# EAGLE design systems-controller (EAGLE 7.6.0)

## Sheet 1 of 4: Power Supply
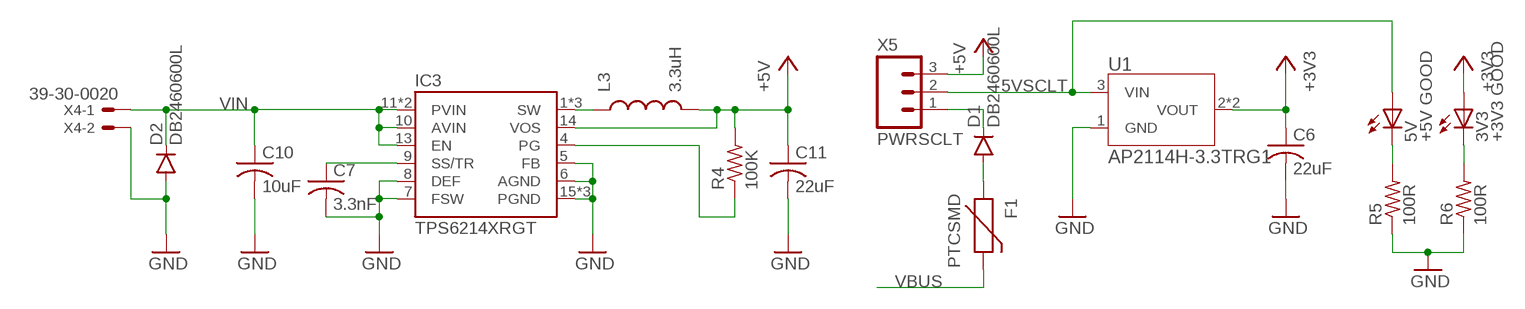
[diagram p0: schematic, sheet 1]

### Parts
3V3  +3V3 GOOD  LEDSML0603  [SML0603]
5V  +5V GOOD  LEDSML0603  [SML0603]
C6  22uF  C-USC0805K  [C0805K]
C7  3.3nF  C-USC0603K  [C0603K]
C10  10uF  C-USC0805K  [C0805K]
C11  22uF  C-USC0805K  [C0805K]
D1  DB2460600L  DIODESOD128  [SOD-128]
D2  DB2460600L  DIODESOD128  [SOD-128]
F1  PTCSMD  [PTC-1206]
IC3  TPS6214XRGT  [16-VQFN]
L3  3.3uH  INDUCTOR-SRN5020  [SRN5020]
R4  100K  R-US_R0603  [R0603]
R5  100R  R-US_R0603  [R0603]
R6  100R  R-US_R0603  [R0603]
U1  AP2114H-3.3TRG1  [SOT-223]
X4  39-30-0020  [39-30-0020]
X5  PWRSCLT  M03PTH  [1X03]

### Nets
5VSCLT: 5V.A U1.3(VIN) X5.2
+3V3: 3V3.A C6.1 U1.2(VOUT) U1.4(VOUT) ; also sheet 2
+5V: C11.1 IC3.14(VOS) L3.2 R4.2 X5.3 ; also sheet 3
GND: C6.2 C7.2 C10.2 C11.2 D2.A IC3.5(FB) IC3.6(AGND) IC3.7(FSW) IC3.8(DEF) IC3.15(PGND) IC3.16(PGND) IC3.PAD(PGND) R5.1 R6.1 U1.1(GND) X4.2 ; also sheet 2,3,4
N$13: IC3.4(PG) R4.1
N$14: C7.1 IC3.9(SS/TR)
N$16: D1.C X5.1
N$17: IC3.1(SW) IC3.2(SW) IC3.3(SW) L3.1
N$20: D1.A F1.1
N$23: 5V.C R5.2
N$24: 3V3.C R6.2
VBUS: F1.2 ; also sheet 2
VIN: C10.1 D2.C IC3.10(AVIN) IC3.11(PVIN) IC3.12(PVIN) IC3.13(EN) X4.1 ; also sheet 3

## Sheet 2 of 4: Microcontroller
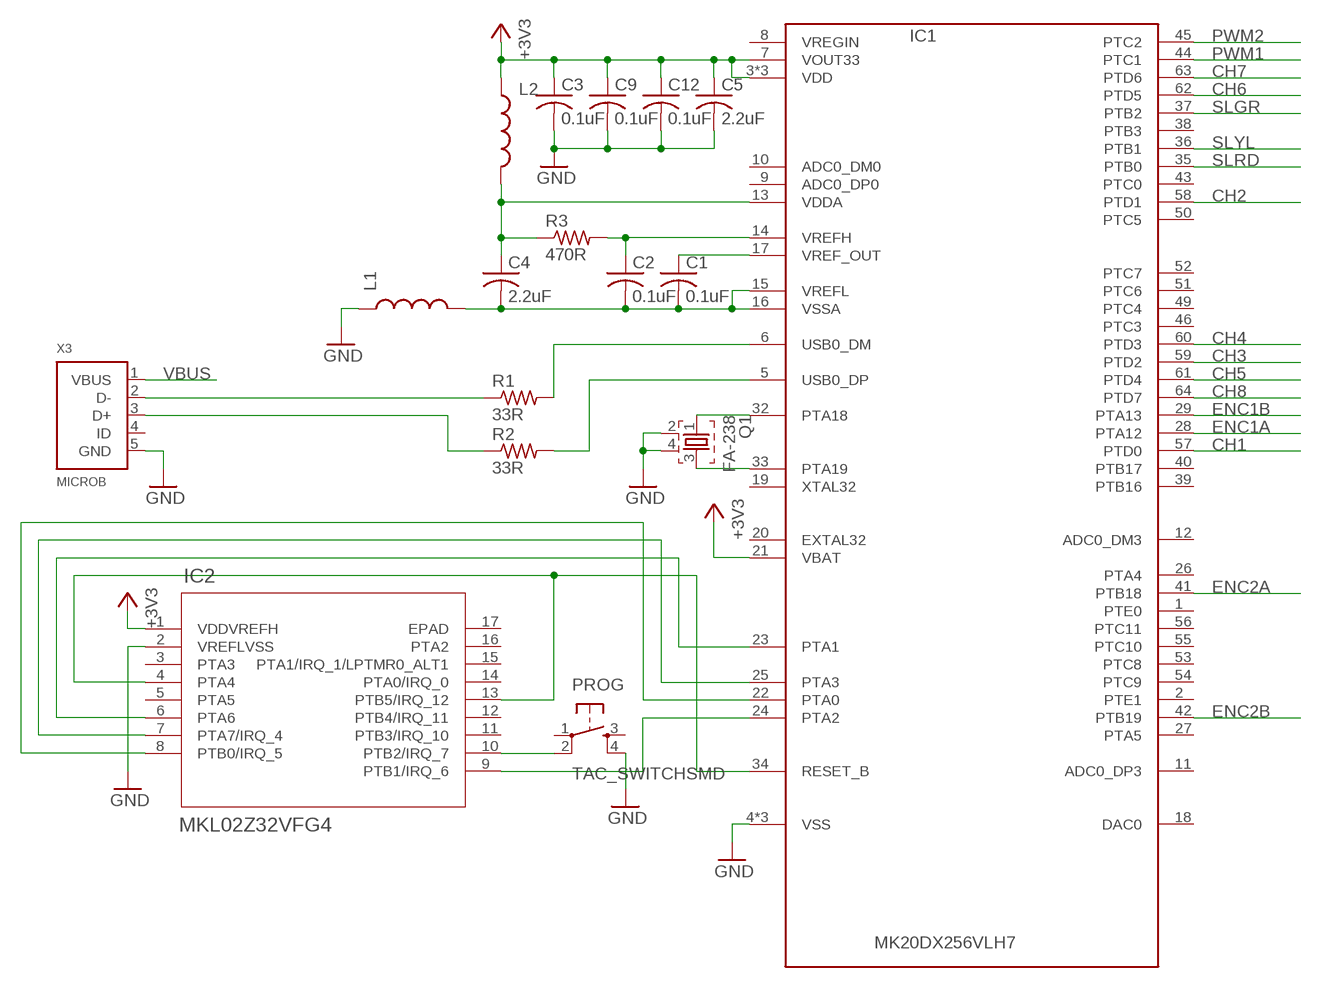
[diagram p1: schematic, sheet 2]

### Parts
C1  0.1uF  C-USC0603K  [C0603K]
C2  0.1uF  C-USC0603K  [C0603K]
C3  0.1uF  C-USC0603K  [C0603K]
C4  2.2uF  C-USC0603K  [C0603K]
C5  2.2uF  C-USC0603K  [C0603K]
C9  0.1uF  C-USC0603K  [C0603K]
C12  0.1uF  C-USC0603K  [C0603K]
IC1  MK20DX256VLH7  [MK20DX256VLH7]
IC2  MKL02Z32VFG4  [QFN-16_3X3X0.65]
L1  INDUCTOR30OHM,1.8A  [0603]
L2  INDUCTOR30OHM,1.8A  [0603]
PROG  TAC_SWITCHSMD  [TACTILE-SWITCH-SMD]
Q1  FA-238  [FA-238]
R1  33R  R-US_R0603  [R0603]
R2  33R  R-US_R0603  [R0603]
R3  470R  R-US_R0603  [R0603]
X3  MICROB  [10118192]

### Nets
+3V3: C3.1 C5.1 C9.1 C12.1 IC1.3(VDD) IC1.7(VOUT33) IC1.21(VBAT) IC1.30(VDD) IC1.48(VDD) IC2.1(VDDVREFH) L2.1 ; also sheet 1
CH1: IC1.57(PTD0) ; also sheet 3
CH2: IC1.58(PTD1) ; also sheet 3
CH3: IC1.59(PTD2) ; also sheet 3
CH4: IC1.60(PTD3) ; also sheet 3
CH5: IC1.61(PTD4) ; also sheet 3
CH6: IC1.62(PTD5) ; also sheet 3
CH7: IC1.63(PTD6) ; also sheet 3
CH8: IC1.64(PTD7) ; also sheet 3
ENC1A: IC1.28(PTA12) ; also sheet 3
ENC1B: IC1.29(PTA13) ; also sheet 3
ENC2A: IC1.41(PTB18) ; also sheet 3
ENC2B: IC1.42(PTB19) ; also sheet 3
GND: C3.2 C5.2 C9.2 C12.2 IC1.4(VSS) IC1.31(VSS) IC1.47(VSS) IC2.2(VREFLVSS) L1.1 PROG.4 Q1.2 Q1.4 X3.5(GND) ; also sheet 1,3,4
N$1: IC1.25(PTA3) IC2.7(PTA7/IRQ_4)
N$2: IC1.22(PTA0) IC2.8(PTB0/IRQ_5)
N$3: IC1.24(PTA2) IC2.9(PTB1/IRQ_6)
N$4: IC1.23(PTA1) IC2.6(PTA6)
N$5: IC1.34(RESET_B) IC2.4(PTA4) IC2.13(PTB5/IRQ_12)
N$6: R1.1 X3.2(D-)
N$7: IC1.6(USB0_DM) R1.2
N$8: R2.1 X3.3(D+)
N$9: IC1.5(USB0_DP) R2.2
N$10: IC1.32(PTA18) Q1.1
N$11: IC1.33(PTA19) Q1.3
N$12: C1.2 C2.2 C4.2 IC1.15(VREFL) IC1.16(VSSA) L1.2
N$15: C1.1 IC1.17(VREF_OUT)
N$18: C2.1 IC1.14(VREFH) R3.2
N$21: C4.1 IC1.13(VDDA) L2.2 R3.1
N$22: IC2.10(PTB2/IRQ_7) PROG.2
PWM1: IC1.44(PTC1) ; also sheet 3
PWM2: IC1.45(PTC2) ; also sheet 3
SLGR: IC1.37(PTB2) ; also sheet 4
SLRD: IC1.35(PTB0) ; also sheet 4
SLYL: IC1.36(PTB1) ; also sheet 4
VBUS: X3.1(VBUS) ; also sheet 1
Unconnected: IC1.1(PTE0) IC1.2(PTE1) IC1.8(VREGIN) IC1.9(ADC0_DP0) IC1.10(ADC0_DM0) IC1.11(ADC0_DP3) IC1.12(ADC0_DM3) IC1.18(DAC0) IC1.19(XTAL32) IC1.20(EXTAL32) IC1.26(PTA4) IC1.27(PTA5) IC1.38(PTB3) IC1.39(PTB16) IC1.40(PTB17) IC1.43(PTC0) IC1.46(PTC3) IC1.49(PTC4) IC1.50(PTC5) IC1.51(PTC6) IC1.52(PTC7) IC1.53(PTC8) IC1.54(PTC9) IC1.55(PTC10) IC1.56(PTC11) IC2.3(PTA3) IC2.5(PTA5) IC2.11(PTB3/IRQ_10) IC2.12(PTB4/IRQ_11) IC2.14(PTA0/IRQ_0) IC2.15(PTA1/IRQ_1/LPTMR0_ALT1) IC2.16(PTA2) IC2.17(EPAD) PROG.1 PROG.3 X3.4(ID)

## Sheet 3 of 4: External Connections
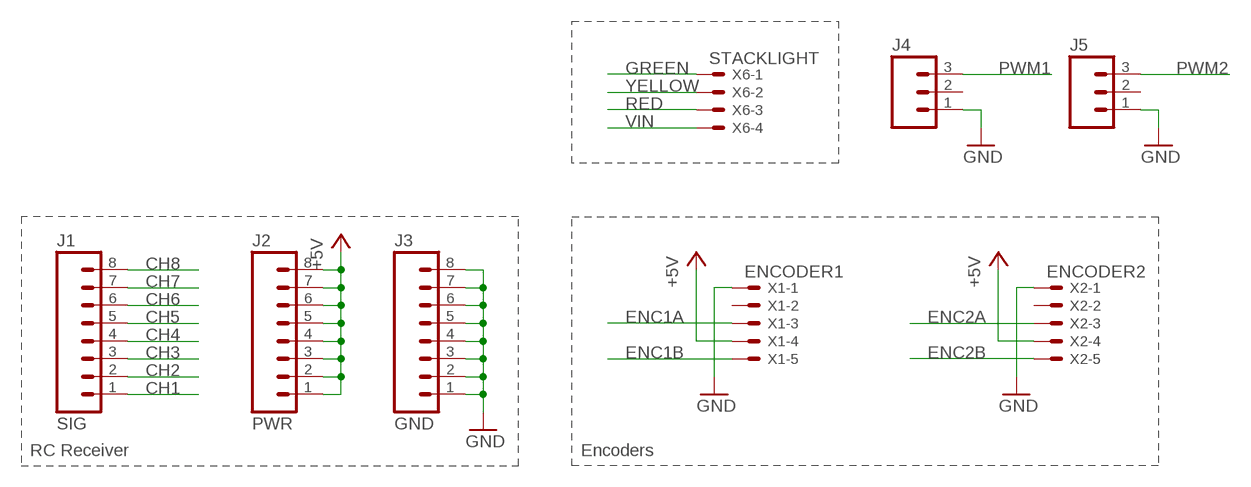
[diagram p2: schematic, sheet 3]

### Parts
J1  SIG  M08  [1X08_ROUND]
J2  PWR  M08  [1X08_ROUND]
J3  GND  M08  [1X08_ROUND]
J4  M03PTH  [1X03]
J5  M03PTH  [1X03]
X1  ENCODER1  C-GRID-05-70553  [70553-05]
X2  ENCODER2  C-GRID-05-70553  [70553-05]
X6  STACKLIGHT  C-GRID-04-70553  [70553-04]

### Nets
+5V: J2.1 J2.2 J2.3 J2.4 J2.5 J2.6 J2.7 J2.8 X1.4 X2.4 ; also sheet 1
CH1: J1.1 ; also sheet 2
CH2: J1.2 ; also sheet 2
CH3: J1.3 ; also sheet 2
CH4: J1.4 ; also sheet 2
CH5: J1.5 ; also sheet 2
CH6: J1.6 ; also sheet 2
CH7: J1.7 ; also sheet 2
CH8: J1.8 ; also sheet 2
ENC1A: X1.3 ; also sheet 2
ENC1B: X1.5 ; also sheet 2
ENC2A: X2.3 ; also sheet 2
ENC2B: X2.5 ; also sheet 2
GND: J3.1 J3.2 J3.3 J3.4 J3.5 J3.6 J3.7 J3.8 J4.1 J5.1 X1.1 X2.1 ; also sheet 1,2,4
GREEN: X6.1 ; also sheet 4
PWM1: J4.3 ; also sheet 2
PWM2: J5.3 ; also sheet 2
RED: X6.3 ; also sheet 4
VIN: X6.4 ; also sheet 1
YELLOW: X6.2 ; also sheet 4
Unconnected: J4.2 J5.2 X1.2 X2.2

### Notes on the sheet
- RC Receiver | Encoders

## Sheet 4 of 4: Stack Light FETs
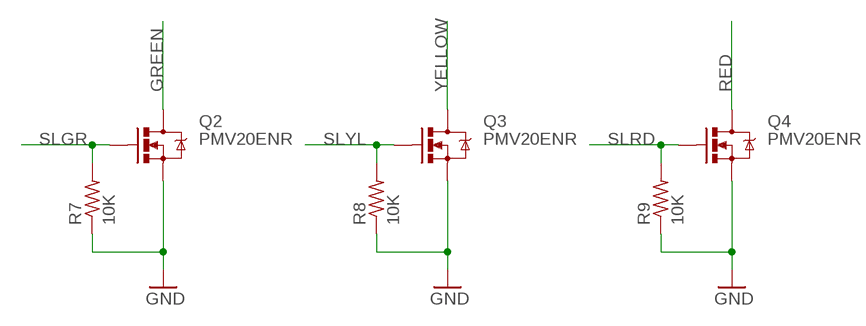
[diagram p3: schematic, sheet 4]

### Parts
Q2  PMV20ENR  MOSFET-NCHANNELAO3404A  [SOT23-3]
Q3  PMV20ENR  MOSFET-NCHANNELAO3404A  [SOT23-3]
Q4  PMV20ENR  MOSFET-NCHANNELAO3404A  [SOT23-3]
R7  10K  R-US_R0603  [R0603]
R8  10K  R-US_R0603  [R0603]
R9  10K  R-US_R0603  [R0603]

### Nets
GND: Q2.2(S) Q3.2(S) Q4.2(S) R7.1 R8.1 R9.1 ; also sheet 1,2,3
GREEN: Q2.3(D) ; also sheet 3
RED: Q4.3(D) ; also sheet 3
SLGR: Q2.1(G) R7.2 ; also sheet 2
SLRD: Q4.1(G) R9.2 ; also sheet 2
SLYL: Q3.1(G) R8.2 ; also sheet 2
YELLOW: Q3.3(D) ; also sheet 3

## Library data of the parts
3V3 5V = led:LED: LED OSRAM: - CHIPLED LG R971, LG N971, LY N971, LG Q971, LY Q971, LO R971, LY R971 LH N974, LH R974 LS Q976, LO Q976, LY Q976 LO Q996 - Hyper CHIPLED LW Q18S LB Q993, LB Q99A, LB R99A - SideLED LS A670, LO A670, LY A670, LG A670, LP A670 LB A673, LV A673, LT A673, LW A673 LH A674 LY A675 LS A676, LA A676, LO A676, LY A676, LW A676 LS A679, LY A679, LG A679 - Hyper Micro SIDELED® LS Y876, LA Y876, LO Y876, LY Y876 LT Y87S - SmartLED LW L88C, LW L88S LB L89C, LB L89S, LG L890 LS L89K, LO L89K, LY L89K LS L896, LA L896, LO L896, LY L896 - TOPLED LS T670, LO T670, LY T670, LG T670, LP T670 LSG T670, LSP T670, LSY T670, LOP T670, LYG T670 LG T671, LOG T671, LSG T671 LB T673, LV T673, LT T673, LW T673 LH T674 LS T676, LA T676, LO T676, LY T676, LB T676, LH T676, LSB T676, LW T676 LB T67C, LV T67C, LT T67C, LS T67K, LO T67K, LY T67K, LW E67C LS E67B, LA E67B, LO E67B, LY E67B, LB E67C, LV E67C, LT E67C LW T67C LS T679, LY T679, LG T679 LS T770, LO T770, LY T770, LG T770, LP T770 LB T773, LV T773, LT T773, LW T773 LH T774 LS E675, LA E675, LY E675, LS T675 LS T776, LA T776, LO T776, LY T776, LB T776 LHGB T686 LT T68C, LB T68C - Hyper Mini TOPLED® LB M676 - Mini TOPLED Santana® LG M470 LS M47K, LO M47K, LY M47K Source: http://www.osram.convergy.de LUXEON: - LUMILED® LXK2-PW12-R00, LXK2-PW12-S00, LXK2-PW14-U00, LXK2-PW14-V00 LXK2-PM12-R00, LXK2-PM12-S00, LXK2-PM14-U00 LXK2-PE12-Q00, LXK2-PE12-R00, LXK2-PE12-S00, LXK2-PE14-T00, LXK2-PE14-U00 LXK2-PB12-K00, LXK2-PB12-L00, LXK2-PB12-M00, LXK2-PB14-N00, LXK2-PB14-P00, LXK2-PB14-Q00 LXK2-PR12-L00, LXK2-PR12-M00, LXK2-PR14-Q00, LXK2-PR14-R00 LXK2-PD12-Q00, LXK2-PD12-R00, LXK2-PD12-S00 LXK2-PH12-R00, LXK2-PH12-S00 LXK2-PL12-P00, LXK2-PL12-Q00, LXK2-PL12-R00 Source: www.luxeon.com KINGBRIGHT: KA-3528ASYC Source: www.kingbright.com
C1-C7 C9-C12 = resistor:C-US: CAPACITOR, American symbol
D1 D2 = SparkFun-DiscreteSemi:DIODE: Diode These are standard reverse protection diodes and small signal diodes. SMA package can handle up to about 1A. SOD-323 can handle about 200mA. What the SOD-323 package when ordering, there are some mfgs out there that are 5-pin packages.
F1 = SparkFun-PowerIC:PTC: Resettable Fuse PTC Resettable Fuse. Spark Fun Electronics SKU : COM-08357; PROD_ID: RES-11150
IC1 = TeensyCustom:MK20DX256VLH7: Teensy 3.1 Processing Unit - MK20DX256VLH7 ARM Cortex M4 Datasheet: K20P64M50SF0.pdf <http://cache.freescale.com/files/32bit/doc/data_sheet/K20P64M50SF0.pdf>
IC2 = TeensyCustom:MKL02Z32VFG4; CPU: ARM Cortex-M0+; FLASHKB: 32; MANUFACTURER_PART_NUMBER: mkl02z32vfg4; MAXFREQUENCY: 48; PINCOUNT: 16; SRAMKB: 4; VENDOR: FREESCALE
IC3 = texas:TPS6214X: TPS6214x 3-V to 17-V 2-A Step-Down Converter in 3 × 3 QFN Package Source: TPS6214x Datasheet <http://www.ti.com/lit/ds/symlink/tps62140.pdf>
J1-J3 = SparkFun-Connectors:M08: Header 8 Standard 8-pin 0.1" header. Use with straight break away headers (SKU : PRT-00116), right angle break away headers (PRT-00553), swiss pins (PRT-00743), machine pins (PRT-00117), and female headers (PRT-00115).; PROD_ID: CONN-08437
J4 J5 X5 = SparkFun-Connectors:M03: Header 3 Standard 3-pin 0.1" header. Use with straight break away headers (SKU : PRT-00116), right angle break away headers (PRT-00553), swiss pins (PRT-00743), machine pins (PRT-00117), and female headers (PRT-00115). Molex polarized connector foot print use with SKU : PRT-08232 with associated crimp pins and housings.
L1 L2 = SparkFun-Passives:INDUCTOR: Inductors Basic Inductor/Choke - 0603 and 1206. Footprints are not proven and vary greatly between part numbers. INDUCTOR POWER 3.3UH 4.0A SMD 0.197" L x 0.197" W x 0.177" H (5.00mm x 5.00mm x 4.50mm); PROD_ID: RES-07859
L3 = bourns:INDUCTOR-: Inductor
PROG = SparkFun-Retired:TAC_SWITCH: Momentary Switch Button commonly used for reset or general input. Spark Fun Electronics SKU : COM-00097 SMT- SWCH-08247; PROD_ID: SWCH-08247
Q1 = crystal:FA-: MHz RANGE CRYSTAL UNIT Source: Epson Toyocom
Q2-Q4 = SparkFun-DiscreteSemi:MOSFET-NCHANNEL: Common NMOSFET Parts MFG P/N Store ID Prod ID FDD8780 TRANS-09984 SI7820DN TRANS-11055 FDS6630A IC-08089 2N7002PW TRANS-11151 FQP30N06L COM-10213 TRANS-10060 BSS123LT1G TRANS-08345 BSS138 TRANS-00830 BS170 2N7000; PROD_ID: TRAN-12988
R1-R9 = resistor:R-US_: RESISTOR, American symbol
U1 = diodes-inc:AP2114H-3.3TRG1; MANUFACTURER_PART_NUMBER: ap2114h-3.3trg1; VENDOR: DIODESINC_2
X1 X2 = con-molex:C-GRID-05: CONNECTOR wire to board 2.54 mm (0.100") pitch header; OC_FARNELL: unknown; OC_NEWARK: unknown
X3 = con-amphenol:MICROB: USB - micro B Amphenol FCI 10118192-0001LF
X4 = con-molex:39-30-0020
X6 = con-molex:C-GRID-04: CONNECTOR wire to board 2.54 mm (0.100") pitch header; OC_FARNELL: unknown; OC_NEWARK: unknown

## Board
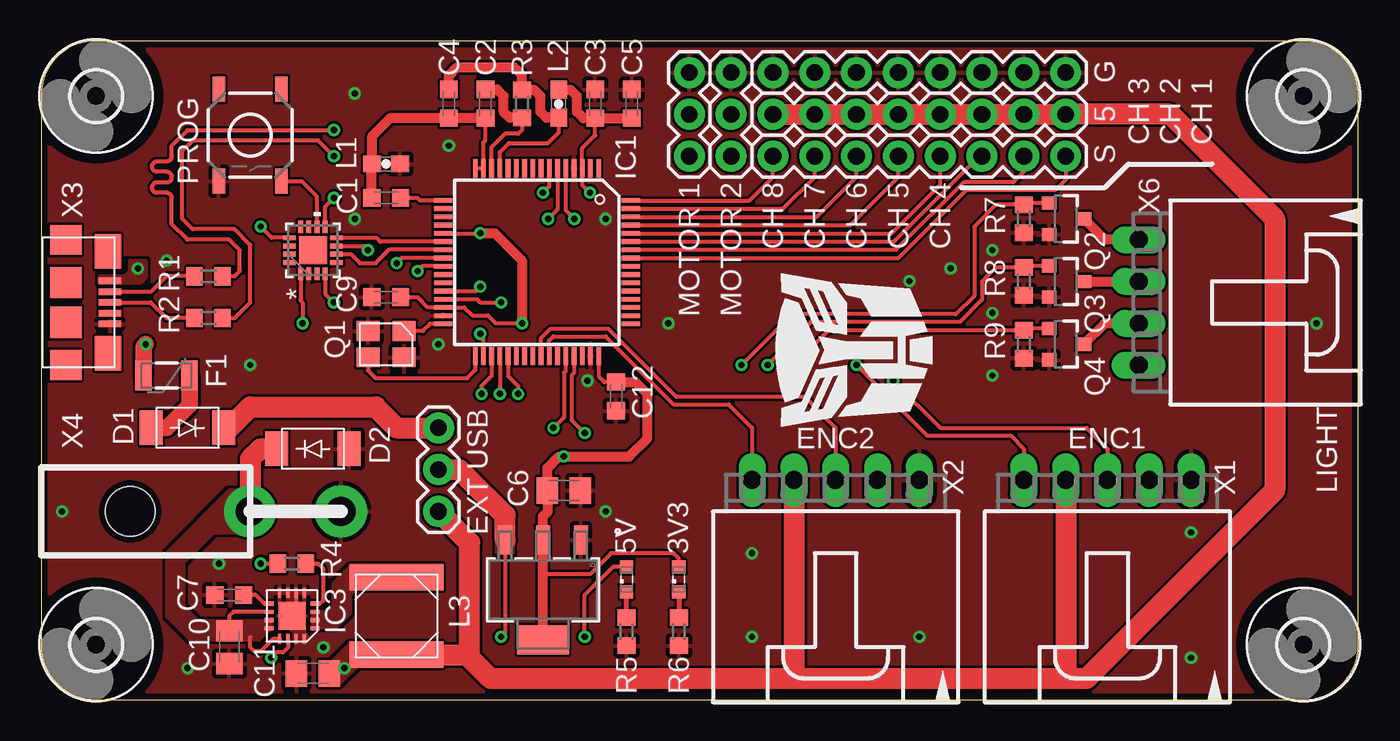
[diagram p4: board, top side]
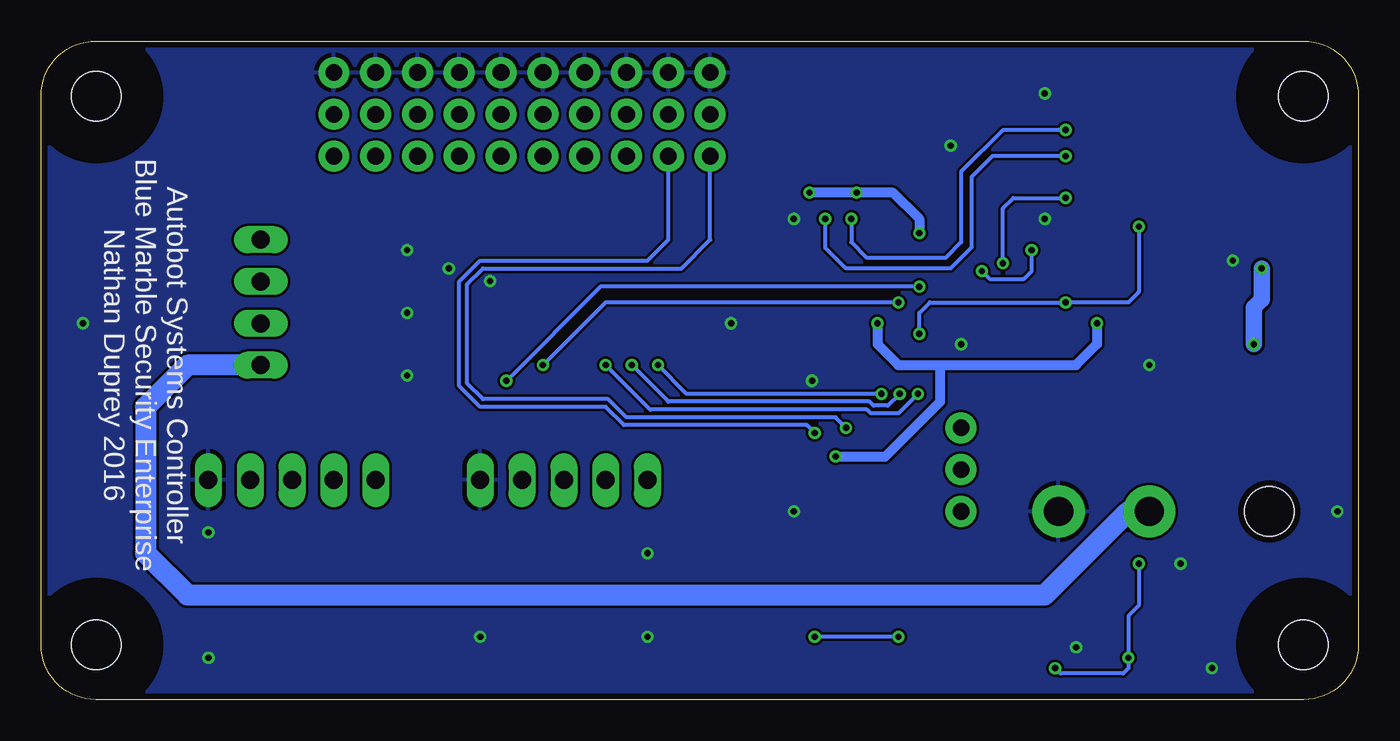
[diagram p5: board, bottom side, seen from below]

Size 80.01 x 40.01 mm. Coordinates in mm from the lower left corner, seen from the top.
Outline: 3.3,0 76.71,0 arc90 80.01,3.3 80.01,36.7 arc90 76.71,40.01 3.3,40.01 arc90 0,36.7 0,3.3 arc90 3.3,0
Copper layers (1*16): Top 0.0356mm / dielectric 1.5011mm / Bottom 0.0356mm
Design rules "oshpark-2layer *": minimum track width 6mil, minimum drill 13mil, track to track 6mil, track to pad 6mil, pad to pad 6mil, via to via 6mil, smd to smd 6mil, copper to edge 15mil, drill to drill 6mil, minimum pad ring 7mil, minimum via ring 7mil, stop-mask expansion 2.5mil, vias tented up to drill 15mil, thermal gap 10mil

### Footprints (pad centres in the part's own frame; a part is rotated, then mirrored left to right if it is on the bottom)
SML0603 = smd 0.8 x 0.8: A 0.75,0; C -0.75,0
C0603K = smd 1.05 x 1.08: 1 -0.875,0; 2 0.875,0
C0805K = smd 1.3 x 1.6: 1 -1,0; 2 1,0
SOD-128 = smd 1.4 x 2.1: A 2.2,0; C -2.2,0
PTC-1206 = smd 1 x 1.8: 1 -1.4,0; 2 1.4,0
MK20DX256VLH7 = smd 1.1 x 0.285: 1 -5.605,3.385; 2 -5.605,2.885; 3 -5.605,2.385; 4 -5.605,1.885; 5 -5.605,1.385; 6 -5.605,0.885; 7 -5.605,0.385; 8 -5.605,-0.115; 9 -5.605,-0.615; 10 -5.605,-1.115; 11 -5.605,-1.615; 12 -5.605,-2.115; 13 -5.605,-2.615; 14 -5.605,-3.115; 15 -5.605,-3.615; 16 -5.605,-4.115; 33 5.795,-4.115; 34 5.795,-3.615; 35 5.795,-3.115; 36 5.795,-2.615; 37 5.795,-2.115; 38 5.795,-1.615; 39 5.795,-1.115; 40 5.795,-0.615; 41 5.795,-0.115; 42 5.795,0.385; 43 5.795,0.885; 44 5.795,1.385; 45 5.795,1.885; 46 5.795,2.385; 47 5.795,2.885; 48 5.795,3.385 | smd 0.285 x 1.1: 17 -3.655,-6.065; 18 -3.155,-6.065; 19 -2.655,-6.065; 20 -2.155,-6.065; 21 -1.655,-6.065; 22 -1.155,-6.065; 23 -0.655,-6.065; 24 -0.155,-6.065; 25 0.345,-6.065; 26 0.845,-6.065; 27 1.345,-6.065; 28 1.845,-6.065; 29 2.345,-6.065; 30 2.845,-6.065; 31 3.345,-6.065; 32 3.845,-6.065; 49 3.845,5.335; 50 3.345,5.335; 51 2.845,5.335; 52 2.345,5.335; 53 1.845,5.335; 54 1.345,5.335; 55 0.845,5.335; 56 0.345,5.335; 57 -0.155,5.335; 58 -0.655,5.335; 59 -1.155,5.335; 60 -1.655,5.335; 61 -2.155,5.335; 62 -2.655,5.335; 63 -3.155,5.335; 64 -3.655,5.335
QFN-16_3X3X0.65 = smd 0.755 x 0.3: 1 -1.427,0.75; 2 -1.427,0.25; 3 -1.427,-0.25; 4 -1.427,-0.75; 9 1.427,-0.75; 10 1.427,-0.25; 11 1.427,0.25; 12 1.427,0.75 | smd 0.3 x 0.755: 5 -0.75,-1.427; 6 -0.25,-1.427; 7 0.25,-1.427; 8 0.75,-1.427; 13 0.75,1.427; 14 0.25,1.427; 15 -0.25,1.427; 16 -0.75,1.427 | smd 1.7 x 1.7: 17 0,0
16-VQFN = smd 0.6 x 0.25: 1 -1.4,0.75; 2 -1.4,0.25; 3 -1.4,-0.25; 4 -1.4,-0.75; 9 1.4,-0.75; 10 1.4,-0.25; 11 1.4,0.25; 12 1.4,0.75 | smd 0.25 x 0.6: 5 -0.75,-1.4; 6 -0.25,-1.4; 7 0.25,-1.4; 8 0.75,-1.4; 13 0.75,1.4; 14 0.25,1.4; 15 -0.25,1.4; 16 -0.75,1.4 | smd 1.7 x 1.7: PAD 0,0
1X08_ROUND = drill 1.016 pad 1.88: 1 0,0; 2 2.54,0; 3 5.08,0; 4 7.62,0; 5 10.16,0; 6 12.7,0; 7 15.24,0; 8 17.78,0
1X03 = drill 1.016 pad 1.88: 1 0,0; 2 2.54,0; 3 5.08,0
0603 = smd 1.1 x 1: 1 -0.85,0; 2 0.85,0
SRN5020 = smd 1.6 x 5.7: 1 -2.35,0; 2 2.35,0
TACTILE-SWITCH-SMD = smd 1.524 x 0.762: 1 -2.794,1.905; 2 2.794,1.905; 3 -2.794,-1.905; 4 2.794,-1.905
FA-238 = smd 1.4 x 1.2: 1 -1.1,-0.8; 2 1.1,-0.8; 3 1.1,0.8; 4 -1.1,0.8
SOT23-3 = smd 0.8 x 0.9: 1 -0.95,-1; 2 0.95,-1; 3 0,1.1
R0603 = smd 1 x 1.1: 1 -0.85,0; 2 0.85,0
SOT-223 = smd 0.851 x 1.761: 1 -2.3,-3.025; 2 0,-3.025; 3 2.3,-3.025 | smd 3.151 x 1.761: 4 0,3.025
3,0 = hole 3: 0,0
70553-05 = drill 1.092 long: 1 -5.08,-7.62; 2 -2.54,-7.62; 3 0,-7.62; 4 2.54,-7.62; 5 5.08,-7.62
10118192 = smd 0.4 x 1.35: 1 -1.3,2.675; 2 -0.65,2.675; 3 0,2.675; 4 0.65,2.675; 5 1.3,2.675 | smd 2.1 x 1.6: P1 -3.1,2.55; P6 3.1,2.55 | smd 1.8 x 1.9: P2 -3.8,0; P5 3.8,0 | smd 1.9 x 1.9: P3 -1.2,0; P4 1.2,0
39-30-0020 = drill 1.778 pad 3.175: 1 0,0; 2 0,5.512 | hole 2.997: 0,-7.29
70553-04 = drill 1.092 long: 1 -3.81,-7.62; 2 -1.27,-7.62; 3 1.27,-7.62; 4 3.81,-7.62

### Placement (x,y rotation side)
3V3  38.73,7.3 90 top
5V  35.56,7.3 90 top
C1  20.95,30.48 180 top
C2  26.99,36.2 270 top
C3  33.66,36.2 90 top
C4  24.77,36.2 270 top
C5  35.88,36.2 90 top
C6  31.75,12.7 0 top
C7  11.43,6.35 180 top
C9  20.95,24.45 180 top
C10  11.43,3.17 270 top
C11  16.51,1.59 180 top
C12  34.92,18.41 270 top
D1  8.89,16.51 180 top
D2  16.51,15.24 0 top
F1  7.62,19.68 180 top
IC1  30.48,26.67 270 top
IC2  16.51,27.3 90 top
IC3  15.24,5.08 180 top
J1  62.23,33.02 180 top
J2  62.23,35.56 180 top
J3  62.23,38.1 180 top
J4  39.37,38.1 270 top
J5  41.91,38.1 270 top
L1  20.95,32.54 180 top
L2  31.43,36.2 270 top
L3  21.59,5.08 270 top
PROG  12.7,34.29 270 top
Q1  20.95,21.59 180 top
Q2  62.23,29.21 270 top
Q3  62.23,25.4 270 top
Q4  62.23,21.59 270 top
R1  10.16,25.72 0 top
R2  10.16,23.18 0 top
R3  29.21,36.2 270 top
R4  15.24,8.26 180 top
R5  35.56,4.13 90 top
R6  38.73,4.13 90 top
R7  59.69,29.21 90 top
R8  59.69,25.4 90 top
R9  59.69,21.59 90 top
U1  30.48,6.67 180 top
U$1  [3,0]  3.33,3.33 0 top
U$2  [3,0]  3.33,36.67 0 top
U$3  [3,0]  76.68,36.67 0 top
U$4  [3,0]  76.68,3.33 0 top
X1  64.77,5.71 180 top
X2  48.26,5.71 180 top
X3  1.51,24.13 270 top
X4  12.7,11.43 270 top
X5  24.13,16.51 270 top
X6  74.3,24.13 270 top

### Tracks (layer width: path | path; a pad name or v marks a point on that pad's centre or on a via)
5VSCLT  (via drill 0.38)
  Top 0.254: U1.3 28.18,4.05 v27.94,3.81 | v33.02,3.81 33.02,6.35 34.72,8.05 5V.A
  Top 1.27: X5.2 25.4,13.97 28.18,11.19 U1.3
  Bottom 0.254: v27.94,3.81 v33.02,3.81
  pour Top (no thermals): 27.68,9.84 27.68,8.94 28.68,8.94 28.68,9.84
+3V3  (via drill 0.38)
  Top 0.254: C3.1 33.66,34.29 32.87,33.5 IC1.3 32.87,31.27 v33.34,30.8 | C9.1 22.86,24.45 23.48,23.82 IC1.30 25.7,23.82 26.19,23.34 27.15,23.34 27.62,22.86 v29.21,22.86 | IC1.21 26.66,28.32 v26.67,28.34 | IC1.7 30.86,31.18 v30.48,30.8 | IC2.1 15.76,24.25 15.88,24.13 v15.88,22.86 | 3V3.A 38.73,8.57 38.42,8.89 34.61,8.89 33.34,7.62 30.48,7.62 | IC1.48 33.87,19.63 34.21,19.29 C12.1
  Top 0.61: C5.1 C3.1 32.94,35.32 32.54,35.72 32.54,36.67 32.17,37.05 L2.1 | U1.4 30.48,7.62 U1.2 30.48,11.11 30.75,11.38 C6.1 30.75,14.08 31.43,14.76 v31.75,14.76 35.72,14.76 36.83,15.88 36.83,18.57 36.11,19.29 C12.1 | v26.67,28.34 27.54,28.34 29.21,26.67 v29.21,22.86
  Bottom 0.61: v26.67,28.34 26.67,29.21 28.26,30.8 v30.48,30.8 v33.34,30.8 | v29.21,22.86 29.21,21.59 27.94,20.32 25.4,20.32 | v15.88,22.86 15.88,21.59 17.14,20.32 25.4,20.32 | v31.75,14.76 28.73,14.76 25.4,18.1 25.4,20.32
+5V  (via drill 0.38)
  Top 0.254: IC3.14 14.99,3.16 14.68,2.86 14.29,2.86 v13.97,2.54 | R4.2 v13.34,8.26
  Top 1.27: 26.04,2.54 26.04,9.53 X5.3 | 62.23,1.27 63.5,1.27 74.93,12.7 74.93,29.21 68.58,35.56 J2.1 J2.2 J2.3 J2.4 J2.5 J2.6 J2.7 J2.8 | 62.23,1.27 45.72,1.27 | 45.72,1.27 27.3,1.27 26.04,2.54 | L3.2 25.84,2.73 26.04,2.54 | X2.4 45.72,1.27 | X1.4 62.23,1.27
  Bottom 0.254: v18.41,1.91 18.1,1.59 14.29,1.59 13.97,1.91 v13.97,2.54 13.97,5.08 13.34,5.71 v13.34,8.26
  pour Top (no thermals): 16.99,0.95 16.99,2.14 17.62,2.22 18.81,3.41 24.29,3.41 24.29,2.06 19.21,2.06 18.1,0.95
CH1
  Top 0.254: J1.1 62.23,31.59 61.59,30.96 56.2,30.96 52.07,26.82 IC1.57
CH2
  Top 0.254: J1.2 59.69,32.07 59.05,31.43 56.04,31.43 51.93,27.32 IC1.58
CH3
  Top 0.254: J1.3 56.99,33.02 51.99,28.02 51.91,27.94 51.8,27.82 IC1.59
CH4
  Top 0.254: IC1.60 51.66,28.32 54.61,31.27 J1.4
CH5
  Top 0.254: IC1.61 49.15,28.82 52.07,31.75 J1.5
CH6
  Top 0.254: IC1.62 47.1,29.32 49.53,31.75 J1.6
CH7
  Top 0.254: IC1.63 45.06,29.82 46.99,31.75 J1.7
CH8
  Top 0.254: IC1.64 43.02,30.32 44.45,31.75 J1.8
ENC1A  (via drill 0.38)
  Top 0.254: IC1.28 26.41,24.82 v26.67,25.08 | v51.75,19.37 54.61,16.51 63.5,16.51 64.77,15.24 X1.3
  Bottom 0.254: v26.67,25.08 46.04,25.08 v51.75,19.37
ENC1B  (via drill 0.38)
  Top 0.254: IC1.29 26.48,24.32 26.67,24.13 v27.94,24.13 | v49.53,20.32 53.82,16.03 58.9,16.03 59.69,15.24 X1.5
  Bottom 0.254: v27.94,24.13 45.72,24.13 v49.53,20.32
ENC2A
  Top 0.254: IC1.41 30.36,21.95 30.96,22.54 34.45,22.54 38.58,18.41 46.35,18.41 48.26,16.51 X2.3
ENC2B
  Top 0.254: IC1.42 30.86,21.82 31.11,22.07 34.29,22.07 38.42,17.94 41.75,17.94 43.18,16.51 X2.5
GND  (via drill 0.38)
  Top 0.254: IC3.PAD 15.24,5.4 15.49,5.65 IC3.6
  other vias: 8.89,1.91 10.79,8.26 17.14,3.17 34.29,11.43 34.29,29.21 24.13,21.59 33.18,19.37 57.78,19.68 57.78,23.5 57.78,27.3 55.24,26.19 38.1,22.86 69.85,10.16 53.34,3.81 69.85,2.54 77.47,22.86 7.62,26.67 19.05,36.83 19.05,29.21 12.7,20.32 1.27,11.43 43.18,8.89 43.18,3.81 24.77,33.66 52.75,25.43
  pour Top (rank 6): 0,0 80.01,0 80.01,40.01 0,40.01
  pour Top (no thermals): 15.56,2.94 15.56,4.13 15.08,4.6 15.95,4.6 15.95,4.05 16.51,3.49 16.51,2.94
  pour Bottom (rank 6): 0,0 80.01,0 80.01,40.01 0,40.01
GREEN
  Top 0.61: X6.1 64.6,27.94 Q2.3
N$1  (via drill 0.38)
  Top 0.254: IC2.7 19.59,27.55 v19.84,27.3 | IC1.25 23.15,26.32 v22.86,26.04
  Bottom 0.254: v22.86,26.04 22.38,25.56 20.32,25.56 19.84,26.04 v19.84,27.3
N$2
  Top 0.254: IC1.22 20.59,27.82 20.36,28.05 IC2.8
N$3  (via drill 0.38)
  Top 0.254: IC1.24 21.9,26.82 v21.59,26.51 | IC2.9 17.26,29.96 v17.78,30.48
  Bottom 0.254: v21.59,26.51 21.59,29.84 20.95,30.48 v17.78,30.48
N$4
  Top 0.254: IC2.6 18.82,27.05 19.37,26.51 20.32,26.51 21.13,27.32 IC1.23
N$5  (via drill 0.38)
  Top 0.254: IC1.34 26.86,22.03 v26.67,22.23 | IC2.4 17.26,24.65 v17.78,24.13 | IC2.13 14.01,28.05 v13.34,28.73
  Bottom 0.254: v26.67,22.23 26.67,23.5 26.04,24.13 v17.78,24.13 13.97,24.13 13.34,24.77 v13.34,28.73
N$6
  Top 0.254: X3.2 6.68,24.78 7.62,25.72 R1.1
N$7  (via drill 0.38)
  Top 0.254: R1.2 11.75,25.72 12.06,26.04 12.06,27.3 11.43,27.94 8.89,27.94 7.94,28.89 7.94,30.47 arc90 7.62,30.79 7.05,30.79 arc-90 6.73,31.11 6.73,31.11 arc-90 7.05,31.43 7.62,31.43 arc90 7.94,31.74 7.94,31.75 arc90 7.62,32.06 7.05,32.06 arc-90 6.73,32.38 6.73,32.38 arc-90 7.05,32.7 7.62,32.7 arc90 7.94,33.02 7.94,33.66 8.89,34.61 v17.78,34.61 | IC1.6 31.36,29.78 v30.8,29.21
  Bottom 0.254: v17.78,34.61 21.59,34.61 24.13,32.07 24.13,27.78 25.08,26.83 29.84,26.83 30.8,27.78 v30.8,29.21
N$8
  Top 0.254: X3.3 6.67,24.13 7.62,23.18 R2.1
N$9  (via drill 0.38)
  Top 0.254: R2.2 11.75,23.18 12.7,24.13 12.7,27.62 11.75,28.57 9.21,28.57 8.57,29.21 8.57,33.34 9.21,33.97 16.83,33.97 v17.78,33.02 | IC1.5 31.86,29.73 v32.38,29.21
  Bottom 0.254: v17.78,33.02 22.23,33.02 23.5,31.75 23.5,27.46 24.77,26.19 31.11,26.19 32.38,27.46 v32.38,29.21
N$10
  Top 0.254: IC1.32 23.62,22.82 23.18,22.38 Q1.1
N$11
  Top 0.254: Q1.3 19.86,19.99 20.32,19.53 25.88,19.53 26.36,20.02 IC1.33
N$12
  Top 0.254: IC1.16 IC1.15 26.86,33.85 26.99,33.97 C2.2
  Top 0.61: C2.2 C4.2 21.19,35.32 20.11,34.23 L1.2 20.08,32.52 C1.2
N$13
  Top 0.254: IC3.4 16.94,5.83 17.14,6.03 17.14,7.94 16.83,8.26 R4.1
N$14
  Top 0.254: IC3.9 13.54,5.83 13.02,6.35 C7.1
N$15
  Top 0.254: IC1.17 23.02,30.32 22.86,30.48 C1.1
N$16
  Top 1.27: D1.C 11.43,16.51 12.7,17.78 20.32,17.78 21.59,16.51 X5.1
N$17
  pour Top (no thermals): 16.51,5.32 17.38,5.32 17.78,5.71 17.78,7.06 18.81,8.1 24.29,8.1 24.29,6.75 19.15,6.75 18.73,6.33 18.73,5.24 17.86,4.37 16.51,4.37
N$18
  Top 0.254: IC1.14 27.36,33.56 28.18,34.37 28.97,34.37 29.21,34.61 R3.2
  Top 0.61: R3.2 28.47,35.34 28.1,35.72 28.1,36.67 27.7,37.07 C2.1
N$20
  Top 1.016: F1.1 9.02,17.91 7.62,16.51 D1.A
N$21
  Top 0.254: IC1.13 27.86,33.26 28.42,33.81 30.8,33.81 31.43,34.45 L2.2
  Top 0.61: L2.2 30.7,35.34 30.32,35.72 30.32,36.67 29.95,37.05 R3.1 29.21,37.94 28.73,38.42 25.24,38.42 24.77,37.94 C4.1
N$22
  Top 0.254: IC2.10 16.76,30.55 15.81,31.5 PROG.2
N$23
  Top 0.305: R5.2 5V.C
N$24
  Top 0.305: 3V3.C R6.2
PWM1  (via drill 0.38)
  Top 0.254: IC1.44 31.86,19.96 31.75,19.84 31.75,17.14 v31.11,16.51
  Bottom 0.254: v31.11,16.51 31.75,17.14 44.45,17.14 45.56,18.26 53.18,18.26 54.13,19.21 54.13,25.24 53.18,26.19 41.12,26.19 39.37,27.94 J4.3
PWM2  (via drill 0.38)
  Top 0.254: IC1.45 32.37,19.82 32.23,19.68 32.23,16.99 v33.02,16.19
  Bottom 0.254: J5.3 41.91,27.94 43.18,26.67 53.34,26.67 54.61,25.4 54.61,19.05 53.34,17.78 45.72,17.78 44.61,16.67 33.5,16.67 v33.02,16.19
RED
  Top 0.61: X6.3 64.6,22.86 Q4.3
SLGR  (via drill 0.38)
  Top 0.254: Q2.1 59.79,30.16 R7.2 58,30.06 56.67,28.73 56.67,24.53 55.56,23.42 45.64,23.42 v42.55,20.32 | IC1.37 28.36,19.66 28.97,19.05 v28.97,18.57
  Bottom 0.254: v28.97,18.57 40.8,18.57 v42.55,20.32
SLRD  (via drill 0.38)
  Top 0.254: Q4.1 59.79,22.54 R9.2 47.84,22.44 v45.72,20.32 | IC1.35 27.36,19.67 26.75,19.05 v26.75,18.57
  Bottom 0.254: v26.75,18.57 27.94,17.38 29.61,17.38 29.84,17.62 43.02,17.62 v45.72,20.32
SLYL  (via drill 0.38)
  Top 0.254: Q3.1 59.79,26.35 R8.2 58,26.25 57.15,25.4 57.15,24.29 55.8,22.94 46.75,22.94 v44.13,20.32 | IC1.36 27.86,19.05 v27.86,18.57
  Bottom 0.254: v27.86,18.57 28.57,17.86 29.45,17.86 29.69,18.1 41.91,18.1 v44.13,20.32
VBUS  (via drill 0.38)
  Top 1.016: F1.2 6.22,21.46 v6.35,21.59
  Bottom 1.016: v5.87,26.19 5.87,24.29 6.35,23.81 v6.35,21.59
  pour Top (no thermals): 3.57,25.72 5.08,25.72 5.4,26.04 5.4,26.67 6.35,26.67 6.35,25.64 6.03,25.32 3.57,25.32
VIN
  Top 0.254: IC3.10 11.68,5.33 11.43,5.08 C10.1 | IC3.13 14.08,3.68 13.34,2.94 12.94,2.94 12.7,3.17 12.7,3.81
  Top 1.27: D2.C 13.34,15.24 12.7,14.61 X4.1
  Bottom 1.27: X6.4 71.12,20.32 73.66,17.78 73.66,8.89 71.12,6.35 19.05,6.35 13.97,11.43 X4.1
  pour Top (no thermals): 10.48,10.16 12.97,10.16 arc90 13.97,11.16 13.97,11.7 arc90 12.97,12.7 11.43,12.7 7.62,8.89 7.62,5.08 9.05,3.65 13.26,3.65 13.97,4.37 13.97,4.76 9.53,4.76 8.65,5.64 8.65,8.33
YELLOW
  Top 0.61: Q3.3 X6.2

### Text on the board
bPlace: Autobot Systems Controller / Blue Marble Security Enterprise / Nathan Duprey 2016
tNames: CH 3 / CH 2 / CH 1 | G | 5 | S | MOTOR 1 | MOTOR 2 | CH 8 | CH 7 | CH 6 | CH 5 | CH 4 | ENC2 | ENC1 | LIGHT | EXT USB